# EasyEDA schematic Robot_schematic.json
TITLE: Robot_HW; REV: 1.0; Date: 2024-03-04; Sheet: 1/1
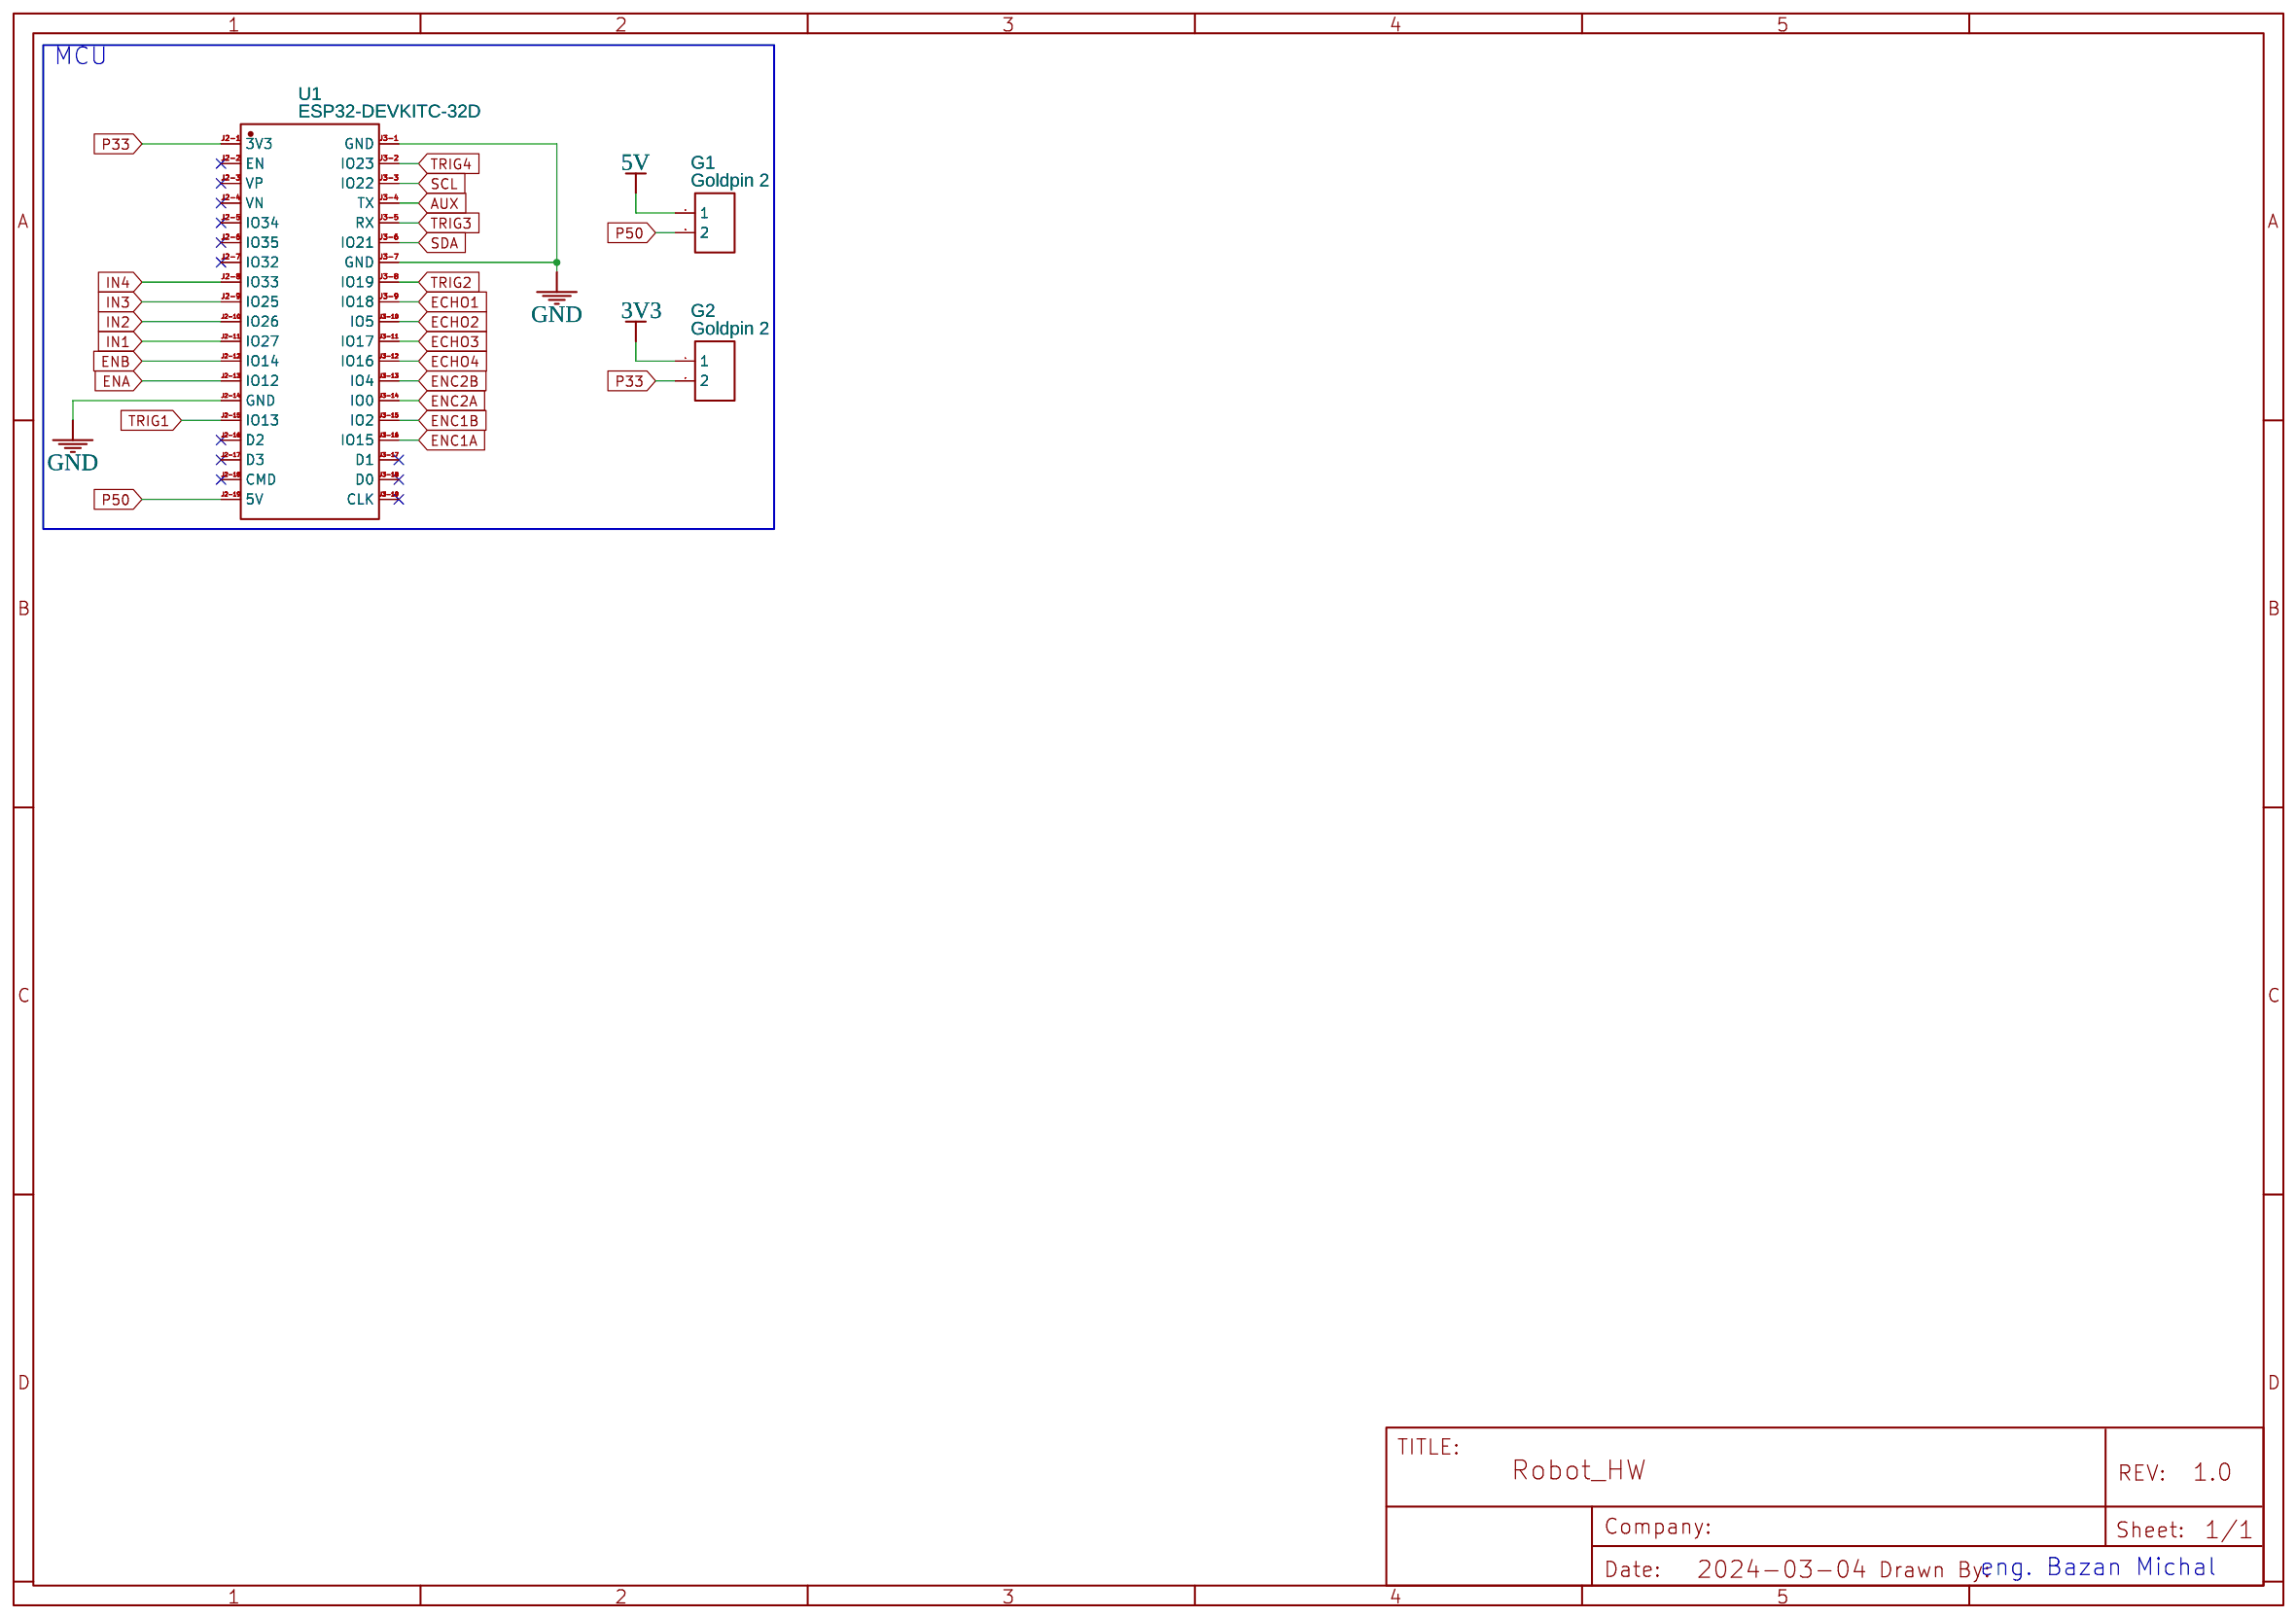
[diagram p0: schematic sheet]

## Parts
G1  Goldpin 2  [GOLDPIN2]
G2  Goldpin 2  [GOLDPIN2]
U1  ESP32-DEVKITC-32D  [COMM-SMD_ESP32-DEVKITC-32D]

## Library data of the parts
G1 G2 = Goldpin 2: Contributor: Photon-t
U1 = ESP32-DEVKITC-32D: Supplier: LCSC; Supplier Part: C571181; Manufacturer: ESPRESSIF(乐鑫); Manufacturer Part: ESP32-DevKitC-32D; JLCPCB Part Class: Extended Part; Contributor: lcsc

## Nets
3V3: G2.1
5V: G1.1
GND: U1.J2-14(GND) U1.J3-1(GND) U1.J3-7(GND)
AUX: U1.J3-4(TX)
ECHO1: U1.J3-9(IO18)
ECHO2: U1.J3-10(IO5)
ECHO3: U1.J3-11(IO17)
ECHO4: U1.J3-12(IO16)
ENA: U1.J2-13(IO12)
ENB: U1.J2-12(IO14)
ENC1A: U1.J3-16(IO15)
ENC1B: U1.J3-15(IO2)
ENC2A: U1.J3-14(IO0)
ENC2B: U1.J3-13(IO4)
IN1: U1.J2-11(IO27)
IN2: U1.J2-10(IO26)
IN3: U1.J2-9(IO25)
IN4: U1.J2-8(IO33)
P33: G2.2 U1.J2-1(3V3)
P50: G1.2 U1.J2-19(5V)
SCL: U1.J3-3(IO22)
SDA: U1.J3-6(IO21)
TRIG1: U1.J2-15(IO13)
TRIG2: U1.J3-8(IO19)
TRIG3: U1.J3-5(RX)
TRIG4: U1.J3-2(IO23)

Not connected (* = marked no-connect by the designer): U1 J2-2(EN)* J2-3(VP)* J2-4(VN)* J2-5(IO34)* J2-6(IO35)* J2-7(IO32)* J2-16(D2)* J2-17(D3)* J2-18(CMD)* J3-17(D1)* J3-18(D0)* J3-19(CLK)*

## Notes on the sheet
- MCU
- eng. Bazan Michal
